# EAGLE design DMX-Controller (EAGLE 7.6.0)
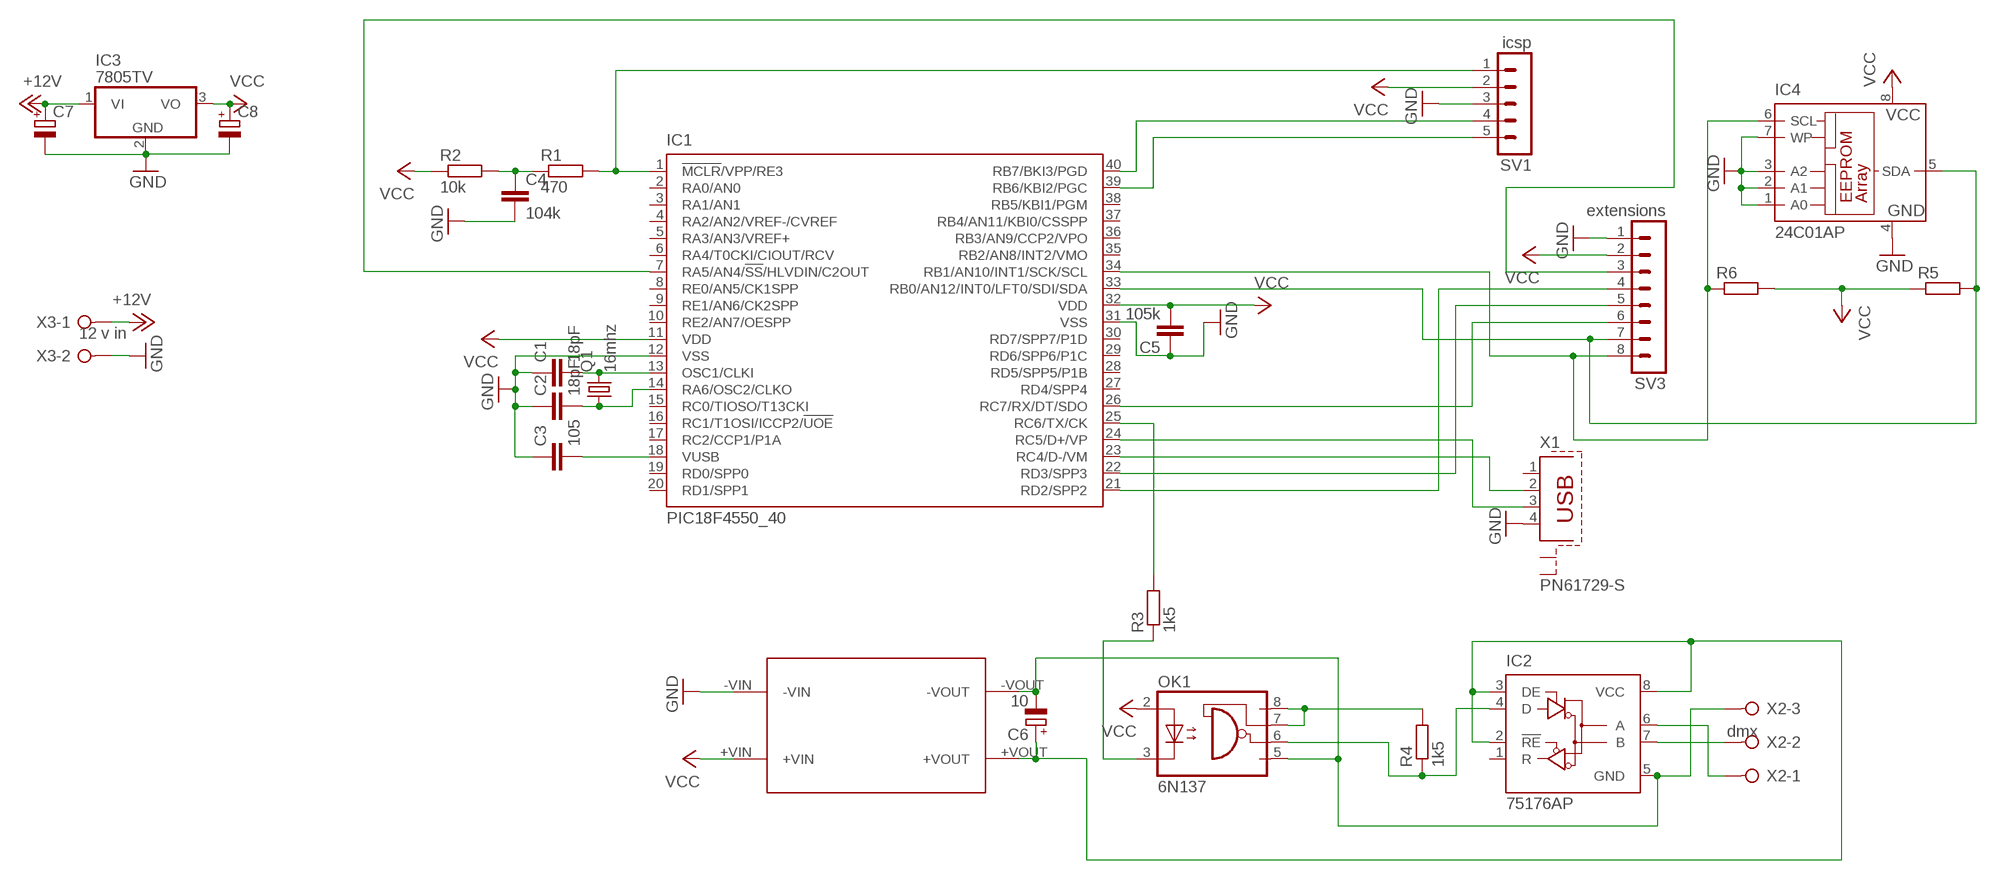
[diagram p0: schematic, sheet 1]

## Parts
C1  18pF  C-EU050-024X044  [C050-024X044]
C2  18pF  C-EU050-024X044  [C050-024X044]
C3  105  C-EU050-024X044  [C050-024X044]
C4  104k  C-EU050-024X044  [C050-024X044]
C5  105k  C-EU050-024X044  [C050-024X044]
C6  10  CPOL-EUE2.5-6  [E2,5-6]
C7  CPOL-EUE2.5-6  [E2,5-6]
C8  CPOL-EUE2.5-6  [E2,5-6]
IC1  PIC18F4550_40  [DIL40]
IC2  75176AP  [DIL08]
IC3  7805TV  [TO220V]
IC4  24C01AP  [DIL8]
OK1  6N137  [DIL08]
Q1  16mhz  CRYSTALHC49U-V  [HC49U-V]
R1  470  R-EU_0207/10  [0207/10]
R2  10k  R-EU_0207/10  [0207/10]
R3  1k5  R-EU_0207/10  [0207/10]
R4  1k5  R-EU_0207/10  [0207/10]
R5  R-EU_0207/10  [0207/10]
R6  R-EU_0207/10  [0207/10]
SV1  icsp  MA05-1  [MA05-1]
SV3  extensions  MA08-1  [MA08-1]
U$1  SIM1-0505SZ  [SIM-0505SZ]
X1  PN61729-S  [PN61729-S]
X2  dmx  W237-3E  [W237-3E]
X3  12 v in  W237-02P  [W237-132]

## Nets
+12V: C7.+ IC3.1(VI) X3.1
GND: C1.1 C2.1 C3.1 C4.2 C5.1 C7.- C8.- IC1.12(VSS) IC1.31(VSS) IC3.2(GND) IC4.1(A0) IC4.2(A1) IC4.3(A2) IC4.4(GND) IC4.7(WP) SV1.3 SV3.1 U$1.-VIN X1.4 X3.2
N$1: C1.2 IC1.13(OSC1/CLKI) Q1.2
N$2: C2.2 IC1.14(RA6/OSC2/CLKO) Q1.1
N$3: C3.2 IC1.18(VUSB)
N$4: IC1.1(!MCLR!/VPP/RE3) R1.2 SV1.1
N$5: IC1.7(RA5/AN4/!SS!/HLVDIN/C2OUT) SV3.3
N$6: IC1.40(RB7/BKI3/PGD) SV1.4
N$7: IC1.24(RC5/D+/VP) X1.3
N$8: IC1.23(RC4/D-/VM) X1.2
N$9: IC1.39(RB6/KBI2/PGC) SV1.5
N$10: OK1.3(C) R3.1
N$11: C6.- IC2.5(GND) OK1.5(GND) U$1.-VOUT X2.3
N$12: C6.+ IC2.2(!RE) IC2.3(DE) IC2.8(VCC) U$1.+VOUT
N$13: IC1.25(RC6/TX/CK) R3.2
N$14: IC1.34(RB1/AN10/INT1/SCK/SCL) IC4.6(SCL) R6.1 SV3.8
N$15: IC1.21(RD2/SPP2) SV3.4
N$16: OK1.7(VE) OK1.8(VCC) R4.2
N$17: IC2.4(D) OK1.6(VO) R4.1
N$18: IC1.22(RD3/SPP3) SV3.5
N$19: IC1.26(RC7/RX/DT/SDO) SV3.6
N$20: IC1.33(RB0/AN12/INT0/LFT0/SDI/SDA) IC4.5(SDA) R5.2 SV3.7
N$22: IC2.6(A) X2.1
N$23: IC2.7(B) X2.2
N$24: C4.1 R1.1 R2.2
VCC: C5.2 C8.+ IC1.11(VDD) IC1.32(VDD) IC3.3(VO) IC4.8(VCC) OK1.2(A) R2.1 R5.1 R6.2 SV1.2 SV3.2 U$1.+VIN
Unconnected: IC1.2(RA0/AN0) IC1.3(RA1/AN1) IC1.4(RA2/AN2/VREF-/CVREF) IC1.5(RA3/AN3/VREF+) IC1.6(RA4/T0CKI/CIOUT/RCV) IC1.8(RE0/AN5/CK1SPP) IC1.9(RE1/AN6/CK2SPP) IC1.10(RE2/AN7/OESPP) IC1.15(RC0/TIOSO/T13CKI) IC1.16(RC1/T1OSI/ICCP2/!UOE) IC1.17(RC2/CCP1/P1A) IC1.19(RD0/SPP0) IC1.20(RD1/SPP1) IC1.27(RD4/SPP4) IC1.28(RD5/SPP5/P1B) IC1.29(RD6/SPP6/P1C) IC1.30(RD7/SPP7/P1D) IC1.35(RB2/AN8/INT2/VMO) IC1.36(RB3/AN9/CCP2/VPO) IC1.37(RB4/AN11/KBI0/CSSPP) IC1.38(RB5/KBI1/PGM) IC2.1(R) X1.1 X1.S1 X1.S2

## Library data of the parts
C1-C5 = rcl:C-EU: CAPACITOR, European symbol
C6-C8 = rcl:CPOL-EU: POLARIZED CAPACITOR, European symbol
IC1 = microchip:PIC18F4*_40: USB Microcontrollers with nanoWatt Technology High-Performance, Enhanced Flash, 28/40/44-Pin, Source: http://ww1.microchip.com/downloads/en/devicedoc/39632c.pdf; MF: MICROCHIP; MPN: PIC18F4550-I/P; OC_FARNELL: 9321357; OC_NEWARK: 74K8623
IC2 = 751xx:75176A: DIFFERENTIAL BUS TRANSCEIVER Source: http://focus.ti.com/lit/ds/symlink/sn75176a.pdf
IC3 = linear:78*: Positive VOLTAGE REGULATOR Source: http://cache.national.com/ds/LM/LM78L05.pdf http://www.fairchildsemi.com/ds/LM/LM7805.pdf
IC4 = microchip:24C*: Serial EEPROM 1 K/2 K/4 K; MF: Arrow Electronics; MPN: M24C01-WBN6P; OC_FARNELL: 9882782; OC_NEWARK: 93K7306
OK1 = optocoupler:6N137: MOTOROLA OPTO COUPLER; MPN: 6N137; OC_FARNELL: 1328376; OC_NEWARK: 52M1895
Q1 = crystal:CRYSTAL: CRYSTAL; OC_FARNELL: 1666969; OC_NEWARK: unknown
R1-R6 = rcl:R-EU_: RESISTOR, European symbol
SV1 = con-lstb:MA05-1: PIN HEADER; OC_FARNELL: unknown; OC_NEWARK: unknown
SV3 = con-lstb:MA08-1: PIN HEADER; OC_FARNELL: unknown; OC_NEWARK: unknown
U$1 = sim-wasweissich:SIM1-0505SZ
X1 = con-berg:PN61729-S: BERG USB connector; OC_FARNELL: unknown; OC_NEWARK: unknown
X2 = con-wago-508:W237-3E: WAGO SREW CLAMP; OC_FARNELL: unknown; OC_NEWARK: unknown
X3 = con-wago-508:W237-02P: WAGO SREW CLAMP; OC_FARNELL: unknown; OC_NEWARK: unknown

## Board
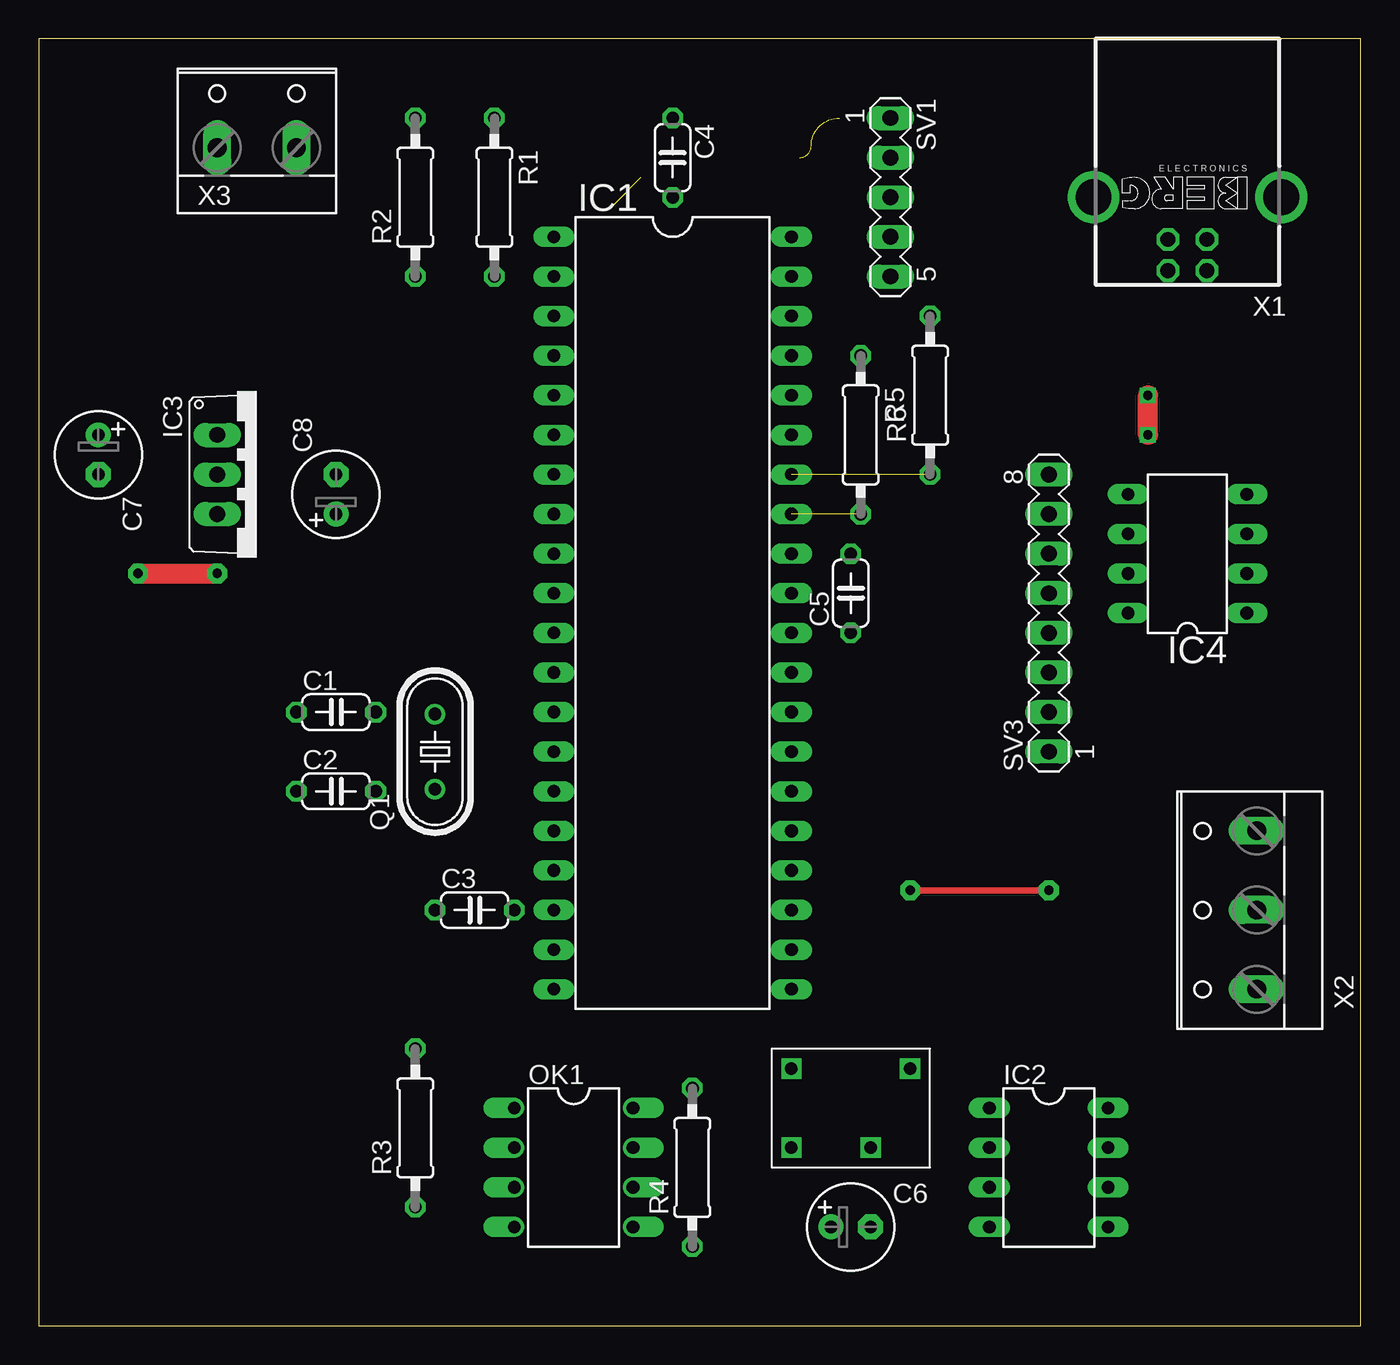
[diagram p1: board, top side]
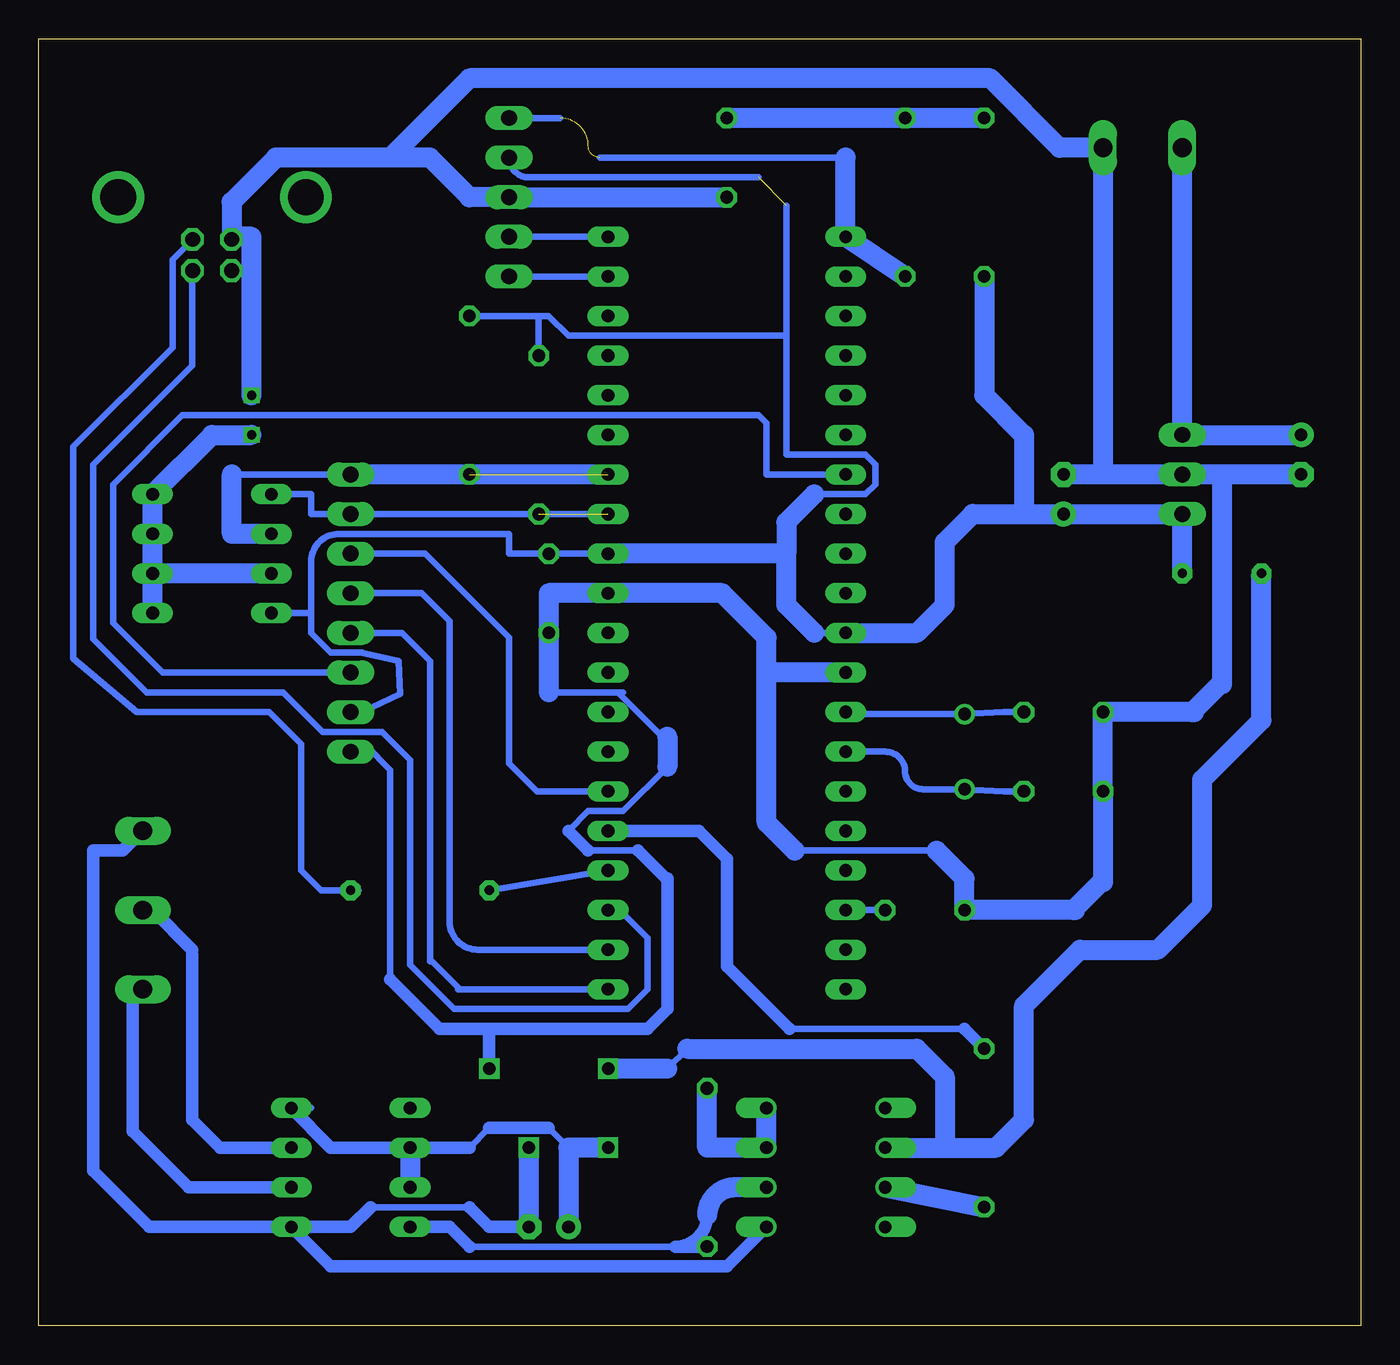
[diagram p2: board, bottom side, seen from below]

Size 84.76 x 82.54 mm. Coordinates in mm from the lower left corner, seen from the top.
Outline: 0,0 84.76,0 84.76,82.54 0,82.54 0,0
Copper layers (1*16): Top 0.035mm / dielectric 1.5mm / Bottom 0.035mm
Design rules "default *": minimum track width 10mil, minimum drill 23mil, track to track 8mil, track to pad 8mil, pad to pad 8mil, via to via 8mil, smd to smd 8mil, copper to edge 40mil, drill to drill 8mil, minimum pad ring 10mil, minimum via ring 8mil, stop-mask expansion 4mil, vias tented up to drill 0mil, thermal gap 10mil

### Footprints (pad centres in the part's own frame; a part is rotated, then mirrored left to right if it is on the bottom)
C050-024X044 = drill 0.813 octagon: 1 -2.54,0; 2 2.54,0
E2,5-6 = drill 0.813 pad 1.6: + -1.27,0 | drill 0.813 pad 1.6 octagon: - 1.27,0
DIL40 = drill 0.813 long: 1 -24.13,-7.62; 2 -21.59,-7.62; 3 -19.05,-7.62; 4 -16.51,-7.62; 5 -13.97,-7.62; 6 -11.43,-7.62; 7 -8.89,-7.62; 8 -6.35,-7.62; 9 -3.81,-7.62; 10 -1.27,-7.62; 11 1.27,-7.62; 12 3.81,-7.62; 13 6.35,-7.62; 14 8.89,-7.62; 15 11.43,-7.62; 16 13.97,-7.62; 17 16.51,-7.62; 18 19.05,-7.62; 19 21.59,-7.62; 20 24.13,-7.62; 21 24.13,7.62; 22 21.59,7.62; 23 19.05,7.62; 24 16.51,7.62; 25 13.97,7.62; 26 11.43,7.62; 27 8.89,7.62; 28 6.35,7.62; 29 3.81,7.62; 30 1.27,7.62; 31 -1.27,7.62; 32 -3.81,7.62; 33 -6.35,7.62; 34 -8.89,7.62; 35 -11.43,7.62; 36 -13.97,7.62; 37 -16.51,7.62; 38 -19.05,7.62; 39 -21.59,7.62; 40 -24.13,7.62
DIL08 = drill 0.813 long: 1 -3.81,-3.81; 2 -1.27,-3.81; 3 1.27,-3.81; 4 3.81,-3.81; 5 3.81,3.81; 6 1.27,3.81; 7 -1.27,3.81; 8 -3.81,3.81
TO220V = drill 1.016 long: 1 -2.54,-2.54; 2 0,-2.54; 3 2.54,-2.54
DIL8 = drill 0.813 long: 1 -3.81,-3.81; 2 -1.27,-3.81; 3 1.27,-3.81; 4 3.81,-3.81; 5 3.81,3.81; 6 1.27,3.81; 7 -1.27,3.81; 8 -3.81,3.81
DIL08' = drill 0.813 offset: 1 -3.81,-3.81; 2 -1.27,-3.81; 3 1.27,-3.81; 4 3.81,-3.81; 5 3.81,3.81; 6 1.27,3.81; 7 -1.27,3.81; 8 -3.81,3.81
HC49U-V = drill 0.813: 1 -2.413,0; 2 2.413,0
0207/10 = drill 0.813 octagon: 1 -5.08,0; 2 5.08,0
MA05-1 = drill 1.016 long: 1 -5.08,0; 2 -2.54,0; 3 0,0; 4 2.54,0; 5 5.08,0
MA08-1 = drill 1.016 long: 1 -8.89,0; 2 -6.35,0; 3 -3.81,0; 4 -1.27,0; 5 1.27,0; 6 3.81,0; 7 6.35,0; 8 8.89,0
SIM-0505SZ = drill 0.8 square: +VIN -2.54,1.27; +VOUT -2.54,-3.81; -VIN 5.08,1.27; -VOUT 2.54,-3.81
PN61729-S = drill 0.95 octagon: 1 1.25,4.71; 2 -1.25,4.71; 3 -1.25,2.71; 4 1.25,2.71 | drill 2.3 pad 2.9: S1 -6.02,0; S2 6.02,0
W237-3E = drill 1.194 long: 1 -5.08,-0.635; 2 0,-0.635; 3 5.08,-0.635
W237-132 = drill 1.194 long: 1 -2.54,-0.635; 2 2.54,-0.635

### Placement (x,y rotation side)
C1  19.05,39.37 0 top
C2  19.05,34.29 0 top
C3  27.94,26.67 0 top
C4  40.64,74.93 270 top
C5  52.07,46.99 90 top
C6  52.07,6.35 0 top
C7  3.81,55.88 270 top
C8  19.05,53.34 90 top
IC1  40.64,45.72 270 top
IC2  64.77,10.16 270 top
IC3  13.97,54.61 270 top
IC4  73.66,49.53 90 top
OK1  6N137  [DIL08']  34.29,10.16 270 top
Q1  25.4,36.83 90 top
R1  29.21,72.39 270 top
R2  24.13,72.39 90 top
R3  24.13,12.7 90 top
R4  41.91,10.16 90 top
R5  52.7,57.15 270 top
R6  57.15,59.69 90 top
SV1  54.61,72.39 270 top
SV3  64.77,45.72 90 top
U$1  50.8,15.24 0 top
X1  73.66,72.39 180 top
X2  77.47,26.67 90 top
X3  13.97,76.2 0 top

### Tracks (layer width: path | path; a pad name or v marks a point on that pad's centre or on a via)
+12V
  Bottom 1.27: X3.1 IC3.1 C7.+
GND  (via drill 0.6)
  Top 1.27: v71.12,57.15 v71.12,59.69
  Bottom 0.406: 54.61,72.37 SV1.3 | C7.- 8.89,54.61 | 27.2,30.48 36.3,30.48 | 52.07,40.64 47.62,40.64 | 47.62,40.64 47.29,40.64 | 49.53,30.48 46.36,30.48 46.25,30.48 | SV3.1 63.76,37.2 62.23,35.67 62.23,22.22 | IC4.2 IC4.3 IC4.4 | 72.41,69.85 X1.4 | 8.89,41.17 9,41.17 | 16.51,28.47 16.62,28.47 | 44.45,37.8 44.78,37.8 47.62,40.64 | 44.45,35.86 47.29,33.02 49.53,33.02 50.8,31.75 | 44.45,28.68 44.56,28.68
  Bottom 0.813: 44.45,28.68 44.45,20.32 45.72,19.05 55.88,19.05 | 55.88,19.05 U$1.-VIN | 55.88,19.05 59.05,19.05 62.23,22.22 | 44.56,28.68 46.36,30.48 | 49.53,30.48 50.8,31.75
  Bottom 1.27: C7.- IC3.2 16.51,54.61 | 16.51,54.61 C8.- | 8.89,54.61 8.89,41.17 | 10.69,39.37 10.8,39.37 | 10.8,39.37 C1.1 C2.1 16.51,28.47 | 16.51,54.61 X3.2 19.3,75.56 23.75,80.01 57.15,80.01 62.23,74.93 | 62.23,74.93 59.69,74.93 57.15,72.39 SV1.3 C4.2 | 62.23,74.93 69.56,74.93 72.41,72.08 X1.4 | IC1.12 38.1,41.91 | 38.1,41.91 38.1,44.15 40.94,46.99 IC1.31 52.07,46.99 C5.1 52.07,40.64 | 18.31,26.67 18.41,26.67 | 18.41,26.67 C3.1 25.4,28.68 27.2,30.48 | 38.1,41.91 38.1,32.28 36.3,30.48 | 44.45,37.8 44.45,35.86 | IC4.1 IC4.2 | IC4.7 IC4.2 | IC4.2 IC4.4 73.66,57.15 v71.12,57.15 | v71.12,59.69 71.12,69.85 72.41,69.85 | 9,41.17 10.8,39.37 | 16.62,28.47 18.41,26.67
N$1
  Bottom 0.406: C1.2 22.86,39.37 Q1.2 33.02,39.24 IC1.13
N$2
  Bottom 0.406: IC1.14 30.48,36.83 arc90 29.21,35.56 arc-90 28.07,34.42 Q1.1 22.86,34.29 C2.2
N$3
  Bottom 0.406: C3.2 IC1.18
N$4  (2 unrouted)
  Bottom 0.406: 33.02,74.93 48.79,74.93 | 51.33,77.47 SV1.1
  Bottom 1.27: R1.2 IC1.1 33.02,74.93
N$5
  Bottom 0.406: IC1.7 38.1,54.61 38.1,57.91 38.61,58.42 75.56,58.42 80.01,53.98 80.01,45.09 76.83,41.91 SV3.3
N$6
  Bottom 0.406: SV1.4 IC1.40
N$7  (via drill 0.6 pad 1.27)
  Top 0.406: v55.88,27.94 v64.77,27.94
  Bottom 0.406: 64.24,27.94 v64.77,27.94 66.67,27.94 67.94,29.21 67.94,37.31 70,39.37 78.48,39.37 82.55,42.8 82.55,56.41 76.2,62.76 76.2,68.39 X1.3 | IC1.24 v55.88,27.94
N$8
  Bottom 0.406: X1.2 74.93,67.68 74.93,61.6 81.28,55.25 81.28,44.06 77.86,40.64 69.11,40.64 66.57,38.1 62.76,38.1 60.96,36.3 60.96,23.16 58.12,20.32 46.99,20.32 45.72,21.59 45.72,24.87 47.52,26.67 IC1.23
N$9
  Bottom 0.406: IC1.39 SV1.5
N$10
  Bottom 1.27: OK1.3 R3.1
N$11
  Bottom 0.406: 57.15,7.62 63.5,7.62
  Bottom 0.813: IC2.5 77.69,6.35 81.28,9.94 81.28,30.48 79.38,30.48 X2.3 | C6.- 55.88,6.35 57.15,7.62 | IC2.5 64.77,6.35 63.5,7.62 | OK1.5 40.64,3.81 66.04,3.81 IC2.5
  Bottom 1.27: C6.- U$1.-VOUT
N$12
  Bottom 0.406: 67.31,13.97 IC2.8 | 50.8,11.43 52.07,12.7 | 55.88,12.7 57.15,11.43
  Bottom 0.813: 52.07,12.7 55.88,12.7 | 57.15,11.43 IC2.2 64.77,11.43 66.04,11.43 IC2.8
  Bottom 1.27: IC2.2 IC2.3 | U$1.+VOUT 50.8,11.43 C6.+
N$13
  Bottom 0.406: 25.4,19.05 36.62,19.05
  Bottom 0.813: IC1.25 42.44,31.75 40.64,29.95 40.64,23.07 36.62,19.05 | R3.2 25.4,19.05
N$14  (1 unrouted)
  Bottom 0.406: 72.39,54.61 SV3.8
  Bottom 1.27: IC1.34 SV3.8 | IC4.6 72.39,50.8 72.39,54.61
N$15
  Bottom 0.406: SV3.4 61.49,44.45 59.69,42.65 59.69,23.5 | 59.69,23.5 59.69,23.39 | IC1.21 57.89,21.59 57.89,21.7 59.69,23.5
N$16
  Bottom 1.27: OK1.8 OK1.7 41.91,11.43 R4.2
N$17
  Bottom 0.406: 43.92,5.08 57.15,5.08
  Bottom 0.813: 41.91,7.09 arc90 43.92,5.08 R4.1 | IC2.4 58.42,6.35 57.15,5.08
  Bottom 1.27: OK1.6 40.11,8.89 arc-90 41.91,7.09
N$18
  Bottom 0.406: SV3.5 60.22,46.99 58.42,45.19 58.42,25.93 arc-90 56.62,24.13 IC1.22
N$19
  Bottom 0.406: SV3.6 59.99,49.53 54.61,44.15 54.61,36.09 52.81,34.29 IC1.26
N$20  (1 unrouted)
  Bottom 0.406: IC1.33 SV3.7 67.31,52.07 67.31,53.34 IC4.5
N$22
  Bottom 0.813: IC2.6 75.15,8.89 78.74,12.48 78.74,21.59 X2.1
N$23
  Bottom 0.406: 77.77,26.67 X2.2 | 74.93,23.83 74.93,24.13
  Bottom 0.813: IC2.7 73.13,11.43 74.93,13.23 74.93,23.83 | 74.93,24.13 77.47,26.67 X2.2
N$24
  Bottom 1.27: R2.2 R1.1 C4.1
VCC  (via drill 0.6 pad 1.27)  (1 unrouted)
  Top 1.27: v6.35,48.26 v11.43,48.26
  Bottom 0.406: IC1.11 35.03,44.45 | IC1.32 C5.2 54.61,49.53 54.61,50.8 65.51,50.8 arc-90 67.31,49 67.31,45.72 | SV1.2 arc-90 53.34,73.66 38.63,73.66 | 36.83,71.86 36.83,63.5 | 36.83,63.5 36.83,55.88 31.75,55.88 31.11,55.25 31.11,53.98 31.75,53.34 35.03,53.34 | 67.31,45.72 67.31,44.45 66.04,43.18 64.13,43.18 | 64.13,43.18 64.03,43.18 | SV3.2 64.03,39.37 61.59,40.53 61.7,42.65 64.13,43.18 | IC4.8 67.31,45.72 | R5.1 52.7,64.77 R6.2 52.07,64.77 50.8,63.5 36.83,63.5 | 44.45,16.51 43.18,17.78
  Bottom 1.27: 36.83,49.53 36.83,46.25 35.03,44.45 | 36.83,49.53 IC1.32 | 36.83,49.53 36.83,51.54 35.03,53.34 | IC1.11 28.47,44.45 26.67,46.25 26.67,50.27 24.87,52.07 21.59,52.07 | 21.59,52.07 C8.+ IC3.3 v11.43,48.26 | OK1.2 26.67,11.43 | 26.67,11.43 23.39,11.43 21.59,13.23 21.59,20.54 18,24.13 13,24.13 10.16,26.97 10.16,35.03 6.35,38.84 v6.35,48.26 | 21.59,52.07 21.59,57.15 24.13,59.69 R2.1 | U$1.+VIN 44.45,16.51 | 43.18,17.78 28.47,17.78 26.67,15.98 26.67,11.43